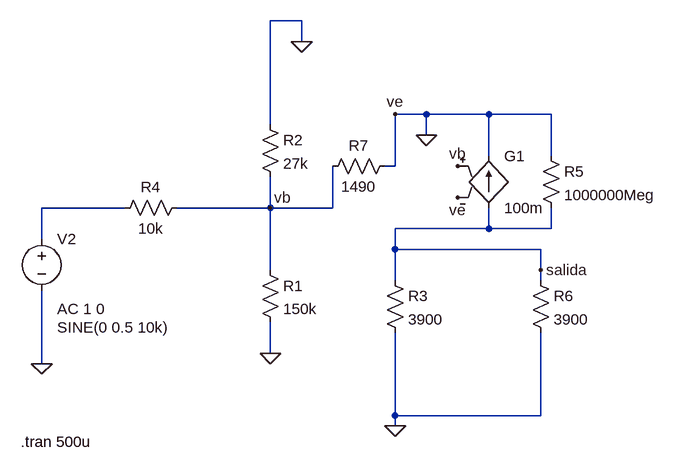
[diagram p0: schematic EjercicioParaEntregarMPS.asc]
EjercicioParaEntregarMPS.asc, the LTspice schematic file:
Version 4
SHEET 1 880 680
WIRE -32 -160 -80 -160
WIRE -32 -128 -32 -160
WIRE 160 -16 112 -16
WIRE 256 -16 160 -16
WIRE 352 -16 256 -16
WIRE -80 0 -80 -160
WIRE 160 16 160 -16
WIRE 256 48 256 -16
WIRE 352 48 352 -16
WIRE 112 64 112 -16
WIRE 112 64 96 64
WIRE -304 128 -432 128
WIRE -80 128 -80 80
WIRE -80 128 -224 128
WIRE 16 128 16 64
WIRE 16 128 -80 128
WIRE 256 160 256 128
WIRE 256 160 112 160
WIRE 352 160 352 128
WIRE 352 160 256 160
WIRE -432 176 -432 128
WIRE 112 192 112 160
WIRE 336 192 112 192
WIRE -80 224 -80 128
WIRE 336 224 336 192
WIRE 112 240 112 192
WIRE 336 240 336 224
WIRE -80 352 -80 304
WIRE -432 368 -432 256
WIRE 112 448 112 320
WIRE 336 448 336 320
WIRE 336 448 112 448
WIRE 112 464 112 448
FLAG -80 352 0
FLAG 112 464 0
FLAG -432 368 0
FLAG 160 16 0
FLAG 336 224 salida
FLAG 208 64 vb
FLAG 208 112 ve
FLAG -80 128 vb
FLAG 112 -16 ve
FLAG -32 -128 0
SYMBOL res -96 208 R0
SYMATTR InstName R1
SYMATTR Value 150k
SYMBOL res -96 -16 R0
SYMATTR InstName R2
SYMATTR Value 27k
SYMBOL res 96 224 R0
SYMATTR InstName R3
SYMATTR Value 3900
SYMBOL voltage -432 160 R0
WINDOW 3 24 152 Left 2
WINDOW 123 24 124 Left 2
WINDOW 39 0 0 Left 0
SYMATTR InstName V2
SYMATTR Value SINE(0 0.5 10k)
SYMATTR Value2 AC 1 0
SYMBOL res -208 112 R90
WINDOW 0 0 56 VBottom 2
WINDOW 3 32 56 VTop 2
SYMATTR InstName R4
SYMATTR Value 10k
SYMBOL res 320 224 R0
SYMATTR InstName R6
SYMATTR Value 3900
SYMBOL res 112 48 R90
WINDOW 0 0 56 VBottom 2
WINDOW 3 32 56 VTop 2
SYMATTR InstName R7
SYMATTR Value 1490
SYMBOL g 256 32 R0
SYMATTR InstName G1
SYMATTR Value 100m
SYMBOL res 336 32 R0
SYMATTR InstName R5
SYMATTR Value 1000000Meg
TEXT -464 488 Left 2 !.tran 500u

The netlist it stands for:
* EjercicioParaEntregarMPS.asc
R1 vb 0 150k
R2 0 vb 27k
R3 salida 0 3900
V2 N001 0 SINE(0 0.5 10k) AC 1 0
R4 vb N001 10k
R6 salida 0 3900
R7 0 vb 1490
G1 salida 0 vb 0 100m
R5 0 salida 1000000Meg
.tran 500u
.backanno
.end